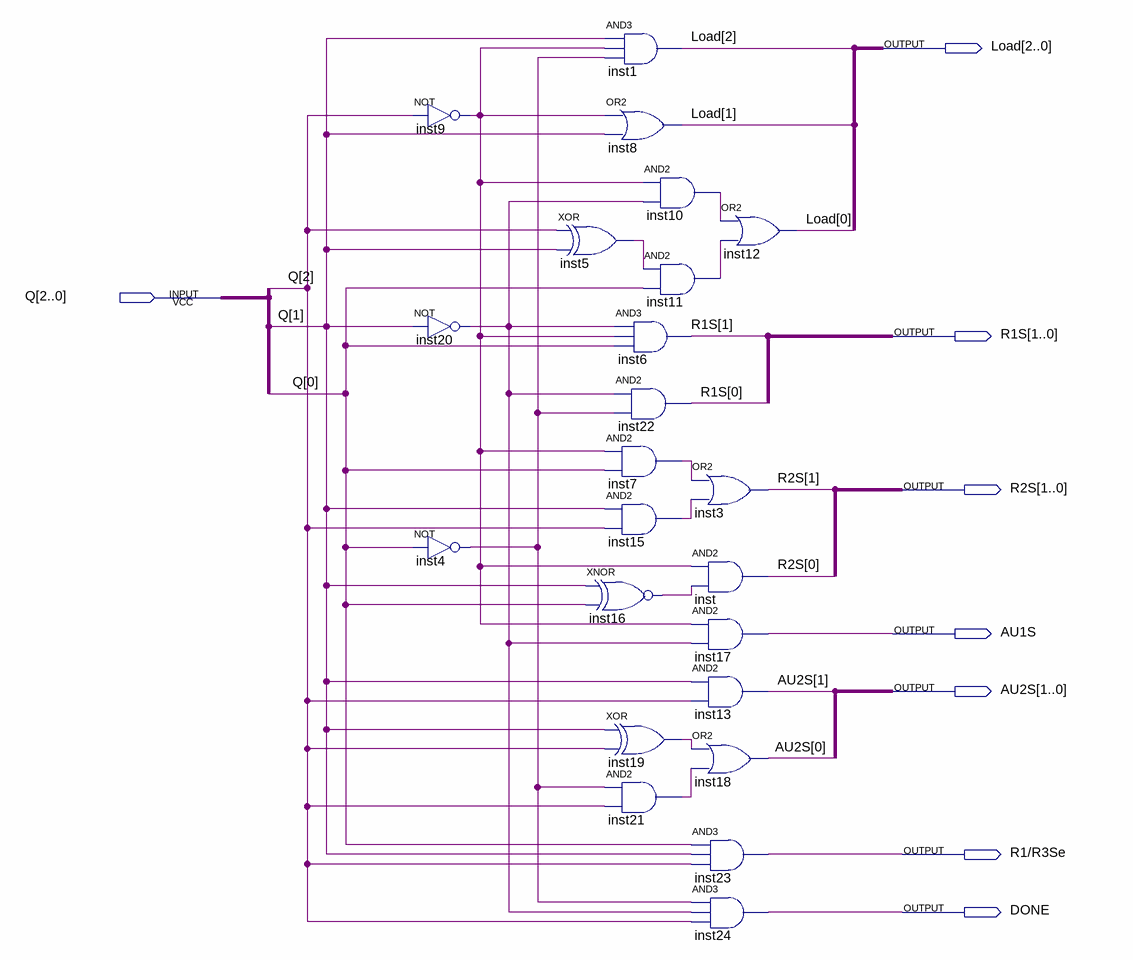
[diagram p0: schematic sheet]
// Quartus schematic OutputLogic.bdf as structural Verilog: 23 symbols, 8 pins
module OutputLogic (
  input  [2:0] Q,
  output [2:0] Load,
  output [1:0] R1S,
  output [1:0] R2S,
  output AU1S,
  output [1:0] AU2S,
  output \R1/R3Se ,
  output DONE
);

  wire inst4_out, inst5_out, inst7_out, inst9_out, inst10_out, inst11_out, inst15_out, inst16_out,
       inst19_out, inst20_out, inst21_out;

  not inst9 (inst9_out, Q[2]);
  not inst20 (inst20_out, Q[1]);
  not inst4 (inst4_out, Q[0]);
  xor inst5 (inst5_out, Q[2], Q[1]);
  xnor inst16 (inst16_out, Q[1], Q[0]);
  and inst1 (Load[2], Q[1], inst9_out, inst4_out);
  or inst8 (Load[1], inst9_out, Q[1]);
  and inst10 (inst10_out, inst9_out, inst20_out);
  and inst11 (inst11_out, inst5_out, Q[0]);
  and inst6 (R1S[1], inst20_out, inst9_out, Q[0]);
  and inst22 (R1S[0], inst20_out, inst4_out);
  and inst7 (inst7_out, inst9_out, Q[0]);
  and inst15 (inst15_out, Q[1], Q[2]);
  xor inst19 (inst19_out, Q[1], Q[2]);
  and inst21 (inst21_out, inst4_out, Q[2]);
  or inst12 (Load[0], inst10_out, inst11_out);
  or inst3 (R2S[1], inst7_out, inst15_out);
  and inst (R2S[0], inst9_out, inst16_out);
  and inst17 (AU1S, inst9_out, inst20_out);
  and inst13 (AU2S[1], Q[1], Q[2]);
  or inst18 (AU2S[0], inst19_out, inst21_out);
  and inst23 (\R1/R3Se , Q[0], Q[1], Q[2]);
  and inst24 (DONE, inst4_out, inst20_out, Q[2]);
endmodule
